# Altium schematic sheet P06 Power3.SchDoc
size 420 x 297 mm
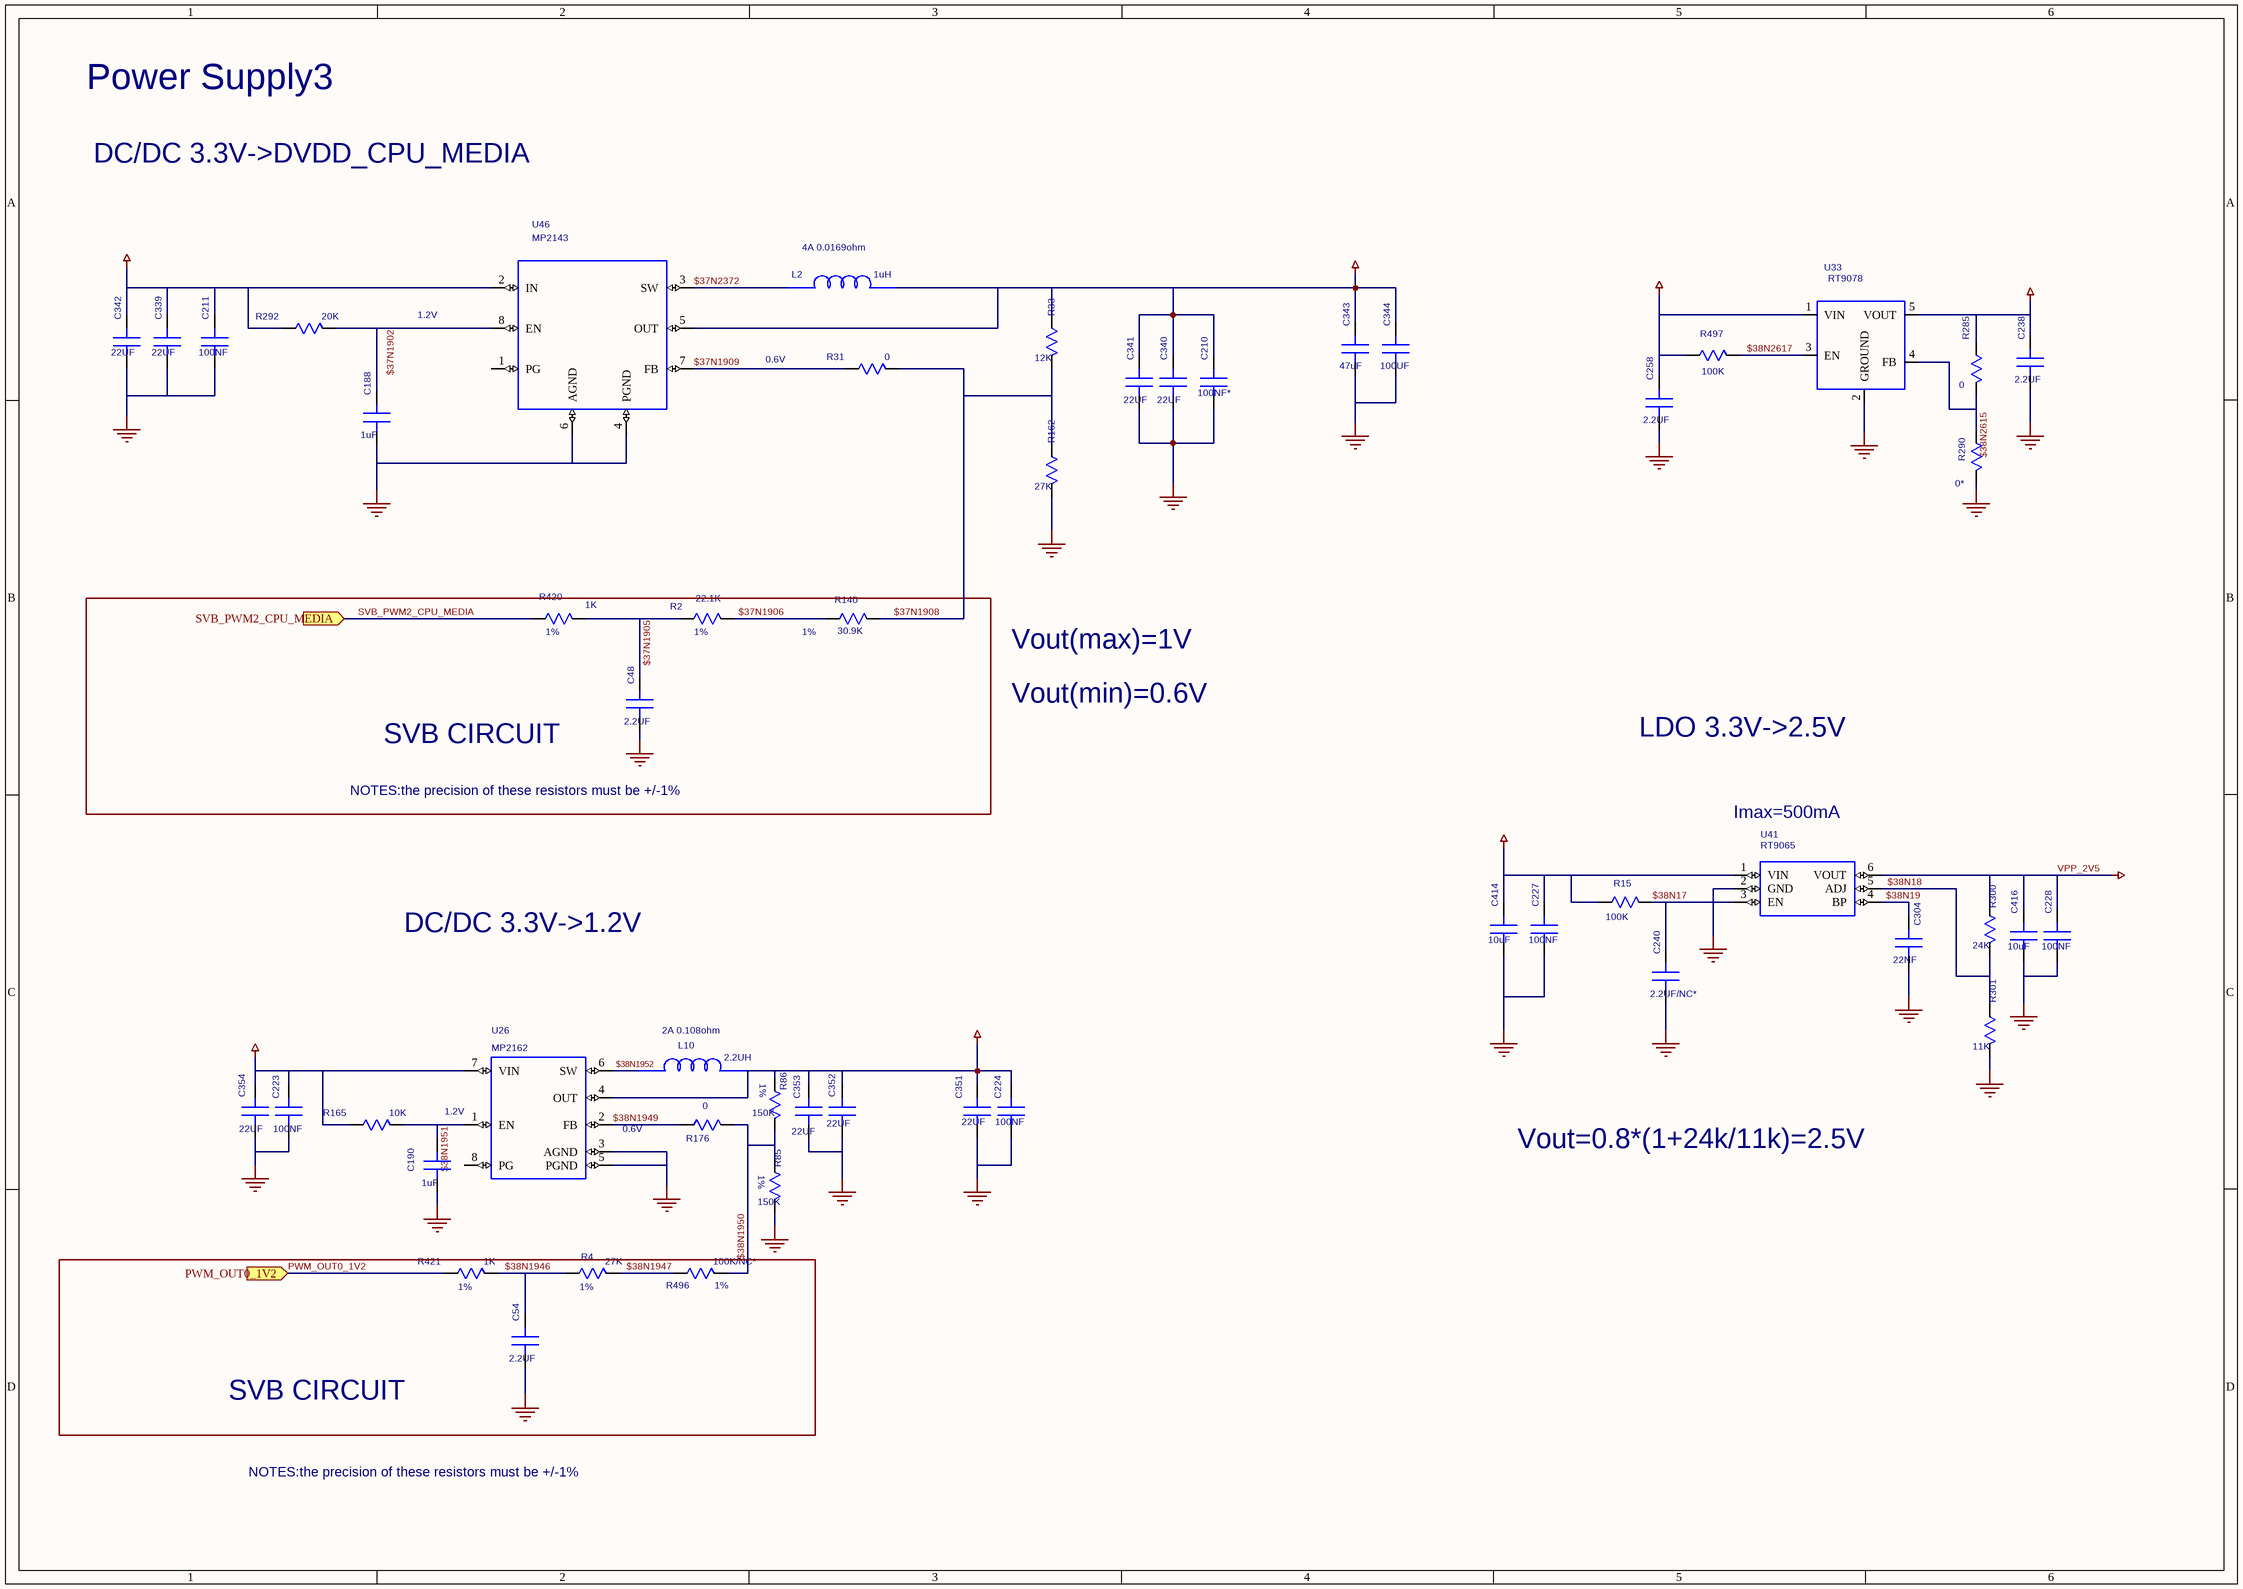
[diagram p0: P06 Power3.SchDoc]

## Parts
C48  2.2UF  [HSC0402]
C54  2.2UF  [HSC0402]
C188  1uF  [SC0402]
C190  1uF  [SC0402]
C210  100NF*  [SC0402]
C211  100NF  [SC0402]
C223  100NF  [SC0402]
C224  100NF  [SC0402]
C227  100NF  [SC0402]
C228  100NF  [SC0402]
C238  2.2UF  [SC0603]
C240  2.2UF/NC*  [SC0603]
C258  2.2UF  [SC0603]
C304  22NF  [SC0402]
C339  22UF  [SC1206]
C340  22UF  [SC1206]
C341  22UF  [SC1206]
C342  22UF  [SC1206]
C343  47uF  [SC1206]
C344  100UF  [SAC6666]
C351  22UF  [SC1206]
C352  22UF  [SC1206]
C353  22UF  [SC1206]
C354  22UF  [SC1206]
C414  10uF  [SC0603]
C416  10uF  [SC0603]
L2  1uH  [SPL0404B]
L10  2.2UH  [HSL1008]
R2  22.1K  [SR0603]
R4  27K  [SR0603]
R15  100K  [SR0402]
R31  0  [SR0402]
R33  12K  [SR0603]
R85  150K  [SR0603]
R86  150K  [SR0603]
R140  30.9K  [SR0603]
R162  27K  [SR0603]
R165  10K  [SR0402]
R176  0  [SR0402]
R285  0  [SR0402]
R290  0*  [SR0402]
R292  20K  [SR0402]
R300  24K  [SR0402]
R301  11K  [SR0402]
R420  1K  [SR0402]
R421  1K  [SR0402]
R496  100K/NC*  [SR0402]
R497  100K  [SR0402]
U26  MP2162  [MLF8M-050-0202L]
U33  RT9078  [SOT23-5-STB]
U41  RT9065  [SOT23-6B]
U46  MP2143  [TSOT23-8]

## Blocks framed on the sheet
SVB CIRCUIT: C48 R2 R140 R420
SVB CIRCUIT: C54 R4 R421 R496

## Ports
PWM_OUT0_1V2, SVB_PWM2_CPU_MEDIA

## Nets
0V8_LDO: C238.1(A) R285.1(A) U33.5(VOUT)
1V2: C224.1(A) C351.1(A) C352.1(A) C353.1(A) L10.2(B) R86.1(A) U26.4(OUT)
1V8: C258.1(A) R497.1(A) U33.1(VIN)
3V3: C211.1(A) C223.1(A) C227.1(A) C339.1(A) C342.1(A) C354.1(A) C414.1(A) R15.1(A) R165.1(A) R292.1(A) U26.7(VIN) U41.1(VIN) U46.2(IN)
DVDD_CPU_MEDIA: C210.1(A) C340.1(A) C341.1(A) C343.1(A) C344.1(A) L2.2(B) R33.1(A) U46.5(OUT)
GND: C48.2(B) C54.2(B) C188.2(B) C190.2(B) C210.2(B) C211.2(B) C223.2(B) C224.2(B) C227.2(B) C228.2(B) C238.2(B) C240.2(B) C258.2(B) C304.2(B) C339.2(B) C340.2(B) C341.2(B) C342.2(B) C343.2(B) C344.2(B) C351.2(B) C352.2(B) C353.2(B) C354.2(B) C414.2(B) C416.2(B) R85.2(B) R162.2(B) R290.2(B) R301.2(B) U26.3(AGND) U26.5(PGND) U33.2(GROUND) U41.2(GND) U46.4(PGND) U46.6(AGND)
VPP_2V5: C228.1(A) C416.1(A) R300.1(A) U41.6(VOUT)
$37N1902: C188.1(A) R292.2(B) U46.8(EN)
$37N1905: C48.1(A) R2.1(A) R420.2(B)
$37N1906: R2.2(B) R140.1(A)
$37N1908: R31.2(B) R33.2(B) R140.2(B) R162.1(A)
$37N1909: R31.1(A) U46.7(FB)
$37N2372: L2.1(A) U46.3(SW)
$38N17: C240.1(A) R15.2(B) U41.3(EN)
$38N18: R300.2(B) R301.1(A) U41.5(ADJ)
$38N19: C304.1(A) U41.4(BP)
$38N1946: C54.1(A) R4.1(A) R421.2(B)
$38N1947: R4.2(B) R496.1(A)
$38N1949: R176.1(A) U26.2(FB)
$38N1950: R85.1(A) R86.2(B) R176.2(B) R496.2(B)
$38N1951: C190.1(A) R165.2(B) U26.1(EN)
$38N1952: L10.1(A) U26.6(SW)
$38N2615: R285.2(B) R290.1(A) U33.4(FB)
$38N2617: R497.2(B) U33.3(EN)
PWM_OUT0_1V2: R421.1(A) ; port PWM_OUT0_1V2
SVB_PWM2_CPU_MEDIA: R420.1(A) ; port SVB_PWM2_CPU_MEDIA

Not connected (* = marked no-connect by the designer): U26 8(PG); U46 1(PG)

## Notes on the sheet
- Power Supply3
- DC/DC 3.3V->DVDD_CPU_MEDIA
- (near L2) 4A 0.0169ohm
- 1.2V
- 0.6V
- (near R420) 1%
- (near R2) 1%
- (near R140) 1%
- Vout(max)=1V
- Vout(min)=0.6V
- NOTES:the precision of these resistors must be +/-1%
- LDO 3.3V->2.5V
- (near U41) Imax=500mA
- DC/DC 3.3V->1.2V
- (near L10) 2A 0.108ohm
- 1%
- (near R85) 1%
- Vout=0.8*(1+24k/11k)=2.5V
- (near R421) 1%
- (near R4) 1%
- (near R496) 1%

## Library data of the parts
C48 = C: PARTS: 1; OriginalSymbolOrigin: (0,0); DEVICE: GRM155C70J225KE11D; LEVEL: STD; PINSWAP: (A,B); CODE: 8071990; %195%%232%%202%%246%: SMD陶瓷电容-6.3V-2200nF-+/-10%-X7S-0402; %182%%238%%182%%168%%185%%164%%215%%247%%181%%231%%209%%185%(V): 6.3; COMPONENT_HIGH_MAX: 0.7mm; %208%%161%%192%%224%%195%%251%%179%%198%: SMD陶瓷电容; PKG_TYPE: HSC0402
C54 = C: PARTS: 1; OriginalSymbolOrigin: (0,0); DEVICE: GRM155C70J225KE11D; LEVEL: STD; PINSWAP: (A,B); %208%%161%%192%%224%%195%%251%%179%%198%: SMD陶瓷电容; %195%%232%%202%%246%: SMD陶瓷电容-6.3V-2200nF-+/-10%-X7S-0402; CODE: 8071990; COMPONENT_HIGH_MAX: 0.7mm; %182%%238%%182%%168%%185%%164%%215%%247%%181%%231%%209%%185%(V): 6.3; PKG_TYPE: HSC0402
C188 = C: PARTS: 1; OriginalSymbolOrigin: (0,0); DEVICE: C1005X6S1A105KT000F; LEVEL: STD; PINSWAP: (A,B); CODE: 8071747; %195%%232%%202%%246%: SMD陶瓷电容-10V-1000nF-+/-10%-X6S-0402; %182%%238%%182%%168%%185%%164%%215%%247%%181%%231%%209%%185%(V): 10; COMPONENT_HIGH_MAX: 0.6mm; %208%%161%%192%%224%%195%%251%%179%%198%: SMD陶瓷电容; PKG_TYPE: SC0402
C190 = C: PARTS: 1; OriginalSymbolOrigin: (0,0); DEVICE: C1005X6S1A105KT000F; LEVEL: STD; PINSWAP: (A,B); %208%%161%%192%%224%%195%%251%%179%%198%: SMD陶瓷电容; COMPONENT_HIGH_MAX: 0.6mm; %182%%238%%182%%168%%185%%164%%215%%247%%181%%231%%209%%185%(V): 10; %195%%232%%202%%246%: SMD陶瓷电容-10V-1000nF-+/-10%-X6S-0402; CODE: 8071747; PKG_TYPE: SC0402
C210 = C: PARTS: 1; OriginalSymbolOrigin: (0,0); DEVICE: RMEMK105BJ104KV_FR; LEVEL: STD; PINSWAP: (A,B); %208%%161%%192%%224%%195%%251%%179%%198%: SMD陶瓷电容; COMPONENT_HIGH_MAX: 0.55MM; %182%%238%%182%%168%%185%%164%%215%%247%%181%%231%%209%%185%(V): 16; %195%%232%%202%%246%: SMD陶瓷电容-16V-100NF-+/-10%-X7R-0402-BT; CODE: 8070614; VARIANT_ID: $37I1928; PKG_TYPE: SC0402
C211 C224 = C: PARTS: 1; OriginalSymbolOrigin: (0,0); DEVICE: RMEMK105BJ104KV_FR; LEVEL: STD; PINSWAP: (A,B); %208%%161%%192%%224%%195%%251%%179%%198%: SMD陶瓷电容; COMPONENT_HIGH_MAX: 0.55MM; %182%%238%%182%%168%%185%%164%%215%%247%%181%%231%%209%%185%(V): 16; %195%%232%%202%%246%: SMD陶瓷电容-16V-100NF-+/-10%-X7R-0402-BT; CODE: 8070614; PKG_TYPE: SC0402
C223 = C: PARTS: 1; OriginalSymbolOrigin: (0,0); DEVICE: RMEMK105BJ104KV_FR; LEVEL: STD; PINSWAP: (A,B); %182%%238%%182%%168%%185%%164%%215%%247%%181%%231%%209%%185%(V): 16; COMPONENT_HIGH_MAX: 0.55MM; CODE: 8070614; %195%%232%%202%%246%: SMD陶瓷电容-16V-100nF-+/-10%-X7R-0402-BT; %208%%161%%192%%224%%195%%251%%179%%198%: SMD陶瓷电容; PKG_TYPE: SC0402
C227 C228 = C: PARTS: 1; OriginalSymbolOrigin: (0,0); DEVICE: RMEMK105BJ104KV_FR; LEVEL: STD; PINSWAP: (A,B); %182%%238%%182%%168%%185%%164%%215%%247%%181%%231%%209%%185%(V): 16; COMPONENT_HIGH_MAX: 0.55MM; CODE: 8070614; %195%%232%%202%%246%: SMD陶瓷电容-16V-100NF-+/-10%-X7R-0402-BT; %208%%161%%192%%224%%195%%251%%179%%198%: SMD陶瓷电容; PKG_TYPE: SC0402
C238 = C: PARTS: 1; OriginalSymbolOrigin: (0,0); DEVICE: GRM188R61A225KE34D; LEVEL: STD; PINSWAP: (A,B); VARIANT_ID: $38I2574; %208%%161%%192%%224%%195%%251%%179%%198%: SMD陶瓷电容; %195%%232%%202%%246%: SMD陶瓷电容-10V-2200NF-+/-10%-X5R-0603; CODE: 8070573; %182%%238%%182%%168%%185%%164%%215%%247%%181%%231%%209%%185%(V): 10; COMPONENT_HIGH_MAX: 0.9MM; PKG_TYPE: SC0603
C240 = C: PARTS: 1; OriginalSymbolOrigin: (0,0); DEVICE: GRM188R61A225KE34D; LEVEL: STD; PINSWAP: (A,B); COMPONENT_HIGH_MAX: 0.9MM; %182%%238%%182%%168%%185%%164%%215%%247%%181%%231%%209%%185%(V): 10; CODE: 8070573; %195%%232%%202%%246%: SMD陶瓷电容-10V-2200NF-+/-10%-X5R-0603; %208%%161%%192%%224%%195%%251%%179%%198%: SMD陶瓷电容; VARIANT_ID: $38I60; PKG_TYPE: SC0603
C258 = C: PARTS: 1; OriginalSymbolOrigin: (0,0); DEVICE: GRM188R61A225KE34D; LEVEL: STD; PINSWAP: (A,B); %195%%232%%202%%246%: SMD陶瓷电容-10V-2200NF-+/-10%-X5R-0603; %208%%161%%192%%224%%195%%251%%179%%198%: SMD陶瓷电容; VARIANT_ID: $38I2574; COMPONENT_HIGH_MAX: 0.9MM; %182%%238%%182%%168%%185%%164%%215%%247%%181%%231%%209%%185%(V): 10; CODE: 8070573; PKG_TYPE: SC0603
C304 = C: PARTS: 1; OriginalSymbolOrigin: (0,0); DEVICE: 0402YC223KAT2A; LEVEL: STD; PINSWAP: (A,B); %208%%161%%192%%224%%195%%251%%179%%198%: SMD陶瓷电容; %195%%232%%202%%246%: SMD陶瓷电容-16V-22NF-+/-10%-X7R-0402; CODE: 8070451; %182%%238%%182%%168%%185%%164%%215%%247%%181%%231%%209%%185%(V): 16; COMPONENT_HIGH_MAX: 0.56MM; PKG_TYPE: SC0402
C339 C342 = C: PARTS: 1; OriginalSymbolOrigin: (0,0); DEVICE: CEJMK316B7226ML_T; LEVEL: STD; PINSWAP: (A,B); %208%%161%%192%%224%%195%%251%%179%%198%: SMD陶瓷电容; COMPONENT_HIGH_MAX: 1.8mm; %182%%238%%182%%168%%185%%164%%215%%247%%181%%231%%209%%185%(V): 6.3; %195%%232%%202%%246%: SMD陶瓷电容-6.3V-22000nF-+/-20%-X7R-1206-所有; CODE: 8070862; PKG_TYPE: SC1206
C340 C341 = C: PARTS: 1; OriginalSymbolOrigin: (0,0); DEVICE: CEJMK316B7226ML_T; LEVEL: STD; PINSWAP: (A,B); CODE: 8070862; %195%%232%%202%%246%: SMD陶瓷电容-6.3V-22000nF-+/-20%-X7R-1206-所有; %182%%238%%182%%168%%185%%164%%215%%247%%181%%231%%209%%185%(V): 6.3; COMPONENT_HIGH_MAX: 1.8mm; %208%%161%%192%%224%%195%%251%%179%%198%: SMD陶瓷电容; PKG_TYPE: SC1206
C343 = C: PARTS: 1; OriginalSymbolOrigin: (0,0); DEVICE: C3216X7S0J476MT000E; LEVEL: STD; PINSWAP: (A,B); %208%%161%%192%%224%%195%%251%%179%%198%: SMD陶瓷电容; COMPONENT_HIGH_MAX: 1.8mm; %182%%238%%182%%168%%185%%164%%215%%247%%181%%231%%209%%185%(V): 4; %195%%232%%202%%246%: SMD陶瓷电容-4V-47000nF-+/-20%-X7S-1206; CODE: 8071432; VARIANT_ID: $37I2387; PKG_TYPE: SC1206
C344 = C: PARTS: 1; OriginalSymbolOrigin: (0,0); DEVICE: CEJMK316B7226ML_T; LEVEL: STD; PINSWAP: (A,B); %208%%161%%192%%224%%195%%251%%179%%198%: 非固体SMD铝电容; COMPONENT_HIGH_MAX: 6.1mm; %182%%238%%182%%168%%185%%164%%215%%247%%181%%231%%209%%185%(V): 16; %195%%232%%202%%246%: 非固体SMD铝电容-16V-100uF-+/-20%-6.3*5.8mm-极性-105degC-2000h-SMD; CODE: 8120045; VARIANT_ID: $37I2400; PKG_TYPE: SAC6666
C351 C353 = C: PARTS: 1; OriginalSymbolOrigin: (0,0); DEVICE: CEJMK316B7226ML_T; LEVEL: STD; PINSWAP: (A,B); %208%%161%%192%%224%%195%%251%%179%%198%: SMD陶瓷电容; %195%%232%%202%%246%: SMD陶瓷电容-6.3V-22000nF-+/-20%-X7R-1206-所有; CODE: 8070862; COMPONENT_HIGH_MAX: 1.8mm; %182%%238%%182%%168%%185%%164%%215%%247%%181%%231%%209%%185%(V): 6.3; PKG_TYPE: SC1206
C352 C354 = C: PARTS: 1; OriginalSymbolOrigin: (0,0); DEVICE: CEJMK316B7226ML_T; LEVEL: STD; PINSWAP: (A,B); %182%%238%%182%%168%%185%%164%%215%%247%%181%%231%%209%%185%(V): 6.3; COMPONENT_HIGH_MAX: 1.8mm; CODE: 8070862; %195%%232%%202%%246%: SMD陶瓷电容-6.3V-22000nF-+/-20%-X7R-1206-所有; %208%%161%%192%%224%%195%%251%%179%%198%: SMD陶瓷电容; PKG_TYPE: SC1206
C414 C416 = C: PARTS: 1; OriginalSymbolOrigin: (0,0); DEVICE: C1608X7S0J106MT000E; LEVEL: STD; PINSWAP: (A,B); %182%%238%%182%%168%%185%%164%%215%%247%%181%%231%%209%%185%(V): 6.3; COMPONENT_HIGH_MAX: 1mm; CODE: 8071624; %195%%232%%202%%246%: SMD陶瓷电容-6.3V-10000nF-+/-20%-X7T-0603; %208%%161%%192%%224%%195%%251%%179%%198%: SMD陶瓷电容; PKG_TYPE: SC0603
L2 = L: PARTS: 1; DEVICE: XAL4020_102MED; LEVEL: STD; OriginalSymbolOrigin: (-20,0); %208%%161%%192%%224%%195%%251%%179%%198%: 贴片电感器; COMPONENT_HIGH_MAX: 2.1MM; %195%%232%%202%%246%: 贴片电感器-1uH-+/-20%-0.014ohm-8.7A-40degC-4*4*2mm; CODE: 10031479; PKG_TYPE: SPL0404B
L10 = L: PARTS: 1; DEVICE: 1239AS_H_2R2N_P2; LEVEL: STD; OriginalSymbolOrigin: (-20,0); COMPONENT_HIGH_MAX: 1.2MM; CODE: 10100175; %195%%232%%202%%246%: 终端功率电感-2.2uH-+/-30%-2A-0.108ohm-2.5*2.0*1.2mm-1008-2.2A; %208%%161%%192%%224%%195%%251%%179%%198%: 终端功率电感; PKG_TYPE: HSL1008
R2 = R_Dup1: PARTS: 1; OriginalSymbolOrigin: (0,0); PINSWAP: (A,B); DEVICE: RK73H1JTTD2212F; LEVEL: STD; %208%%161%%192%%224%%195%%251%%179%%198%: 片式厚膜电阻器; COMPONENT_HIGH_MAX: 0.55mm; %215%%232%%214%%181%%212%%202%%208%%237%%198%%171%%178%%238%: +/-1%; %182%%238%%182%%168%%185%%166%%194%%202%(W): 0.1; %195%%232%%202%%246%: 片式厚膜电阻器-0.1W-22100ohm-+/-1%-0603; CODE: 7091267; PKG_TYPE: SR0603
R4 = R_Dup1: PARTS: 1; OriginalSymbolOrigin: (0,0); PINSWAP: (A,B); DEVICE: RC0603FR_0727KL; LEVEL: STD; COMPONENT_HIGH_MAX: 0.55MM; CODE: 7091669; %195%%232%%202%%246%: 片式厚膜电阻器-0.1W-27000ohm-+/-1%-0603--供电专用 07090937-供电专用; %208%%161%%192%%224%%195%%251%%179%%198%: 片式厚膜电阻器; PKG_TYPE: SR0603
R15 R497 = R_Dup1: PARTS: 1; OriginalSymbolOrigin: (0,0); PINSWAP: (A,B); DEVICE: RK73H1ETTP1003F; LEVEL: STD; COMPONENT_HIGH_MAX: 0.4mm; CODE: 7090875; %195%%232%%202%%246%: 片式厚膜电阻器-0.0625W-100000ohm-+/-1%-0402; %208%%161%%192%%224%%195%%251%%179%%198%: 片式厚膜电阻器; PKG_TYPE: SR0402
R31 = R_Dup1: PARTS: 1; OriginalSymbolOrigin: (0,0); PINSWAP: (A,B); DEVICE: RC0402JR_070R; LEVEL: STD; %215%%232%%214%%181%%212%%202%%208%%237%%198%%171%%178%%238%: < 50mohm; %182%%238%%182%%168%%185%%166%%194%%202%(W): 0.06; CODE: 7090800; %195%%232%%202%%246%: 片式厚膜电阻器-0.0625W-0ohm-< 50mohm-0402-1A-BT; COMPONENT_HIGH_MAX: 0.4mm; %208%%161%%192%%224%%195%%251%%179%%198%: 片式厚膜电阻器; PKG_TYPE: SR0402
R33 = R_Dup1: PARTS: 1; OriginalSymbolOrigin: (0,0); PINSWAP: (A,B); DEVICE: RHS_03K123FT; LEVEL: STD; CODE: 7091203; %195%%232%%202%%246%: 片式厚膜电阻器-0.1W-12000ohm-+/-1%-0603; %182%%238%%182%%168%%185%%166%%194%%202%(W): 0.1; %215%%232%%214%%181%%212%%202%%208%%237%%198%%171%%178%%238%: +/-1%; COMPONENT_HIGH_MAX: 0.55mm; %208%%161%%192%%224%%195%%251%%179%%198%: 片式厚膜电阻器; PKG_TYPE: SR0603
R85 R86 = R_Dup1: PARTS: 1; OriginalSymbolOrigin: (0,0); PINSWAP: (A,B); DEVICE: RK73H1JTTD1503F; LEVEL: STD; %208%%161%%192%%224%%195%%251%%179%%198%: 片式厚膜电阻器; %195%%232%%202%%246%: 片式厚膜电阻器-0.1W-150000ohm-+/-1%-0603; CODE: 7091239; COMPONENT_HIGH_MAX: 0.55MM; PKG_TYPE: SR0603
R140 = R_Dup1: PARTS: 1; OriginalSymbolOrigin: (0,0); PINSWAP: (A,B); DEVICE: RC_03K3092FT; LEVEL: STD; %215%%232%%214%%181%%212%%202%%208%%237%%198%%171%%178%%238%: +/-1%; %182%%238%%182%%168%%185%%166%%194%%202%(W): 0.1; %208%%161%%192%%224%%195%%251%%179%%198%: 片式厚膜电阻器; COMPONENT_HIGH_MAX: 0.55mm; %195%%232%%202%%246%: 片式厚膜电阻器-0.1W-30900ohm-+/-1%-0603; CODE: 7090665; PKG_TYPE: SR0603
R162 = R_Dup1: PARTS: 1; OriginalSymbolOrigin: (0,0); PINSWAP: (A,B); DEVICE: RK73H1JTTD2702F; LEVEL: STD; %208%%161%%192%%224%%195%%251%%179%%198%: 片式厚膜电阻器; COMPONENT_HIGH_MAX: 0.55mm; %195%%232%%202%%246%: 片式厚膜电阻器-0.1W-27000ohm-+/-1%-0603; CODE: 7090937; %182%%238%%182%%168%%185%%166%%194%%202%(W): 0.1; %215%%232%%214%%181%%212%%202%%208%%237%%198%%171%%178%%238%: +/-1%; PKG_TYPE: SR0603
R165 = R_Dup1: PARTS: 1; OriginalSymbolOrigin: (0,0); PINSWAP: (A,B); DEVICE: RC_02W103JT; LEVEL: STD; CODE: 7090815; %195%%232%%202%%246%: 片式厚膜电阻器-0.0625W-10000ohm-+/-5%-0402-BT; %182%%238%%182%%168%%185%%166%%194%%202%(W): 0.06; %215%%232%%214%%181%%212%%202%%208%%237%%198%%171%%178%%238%: +/-5%; COMPONENT_HIGH_MAX: 0.4mm; %208%%161%%192%%224%%195%%251%%179%%198%: 片式厚膜电阻器; PKG_TYPE: SR0402
R176 = R_Dup1: PARTS: 1; OriginalSymbolOrigin: (0,0); PINSWAP: (A,B); DEVICE: RC0402JR_070R; LEVEL: STD; %208%%161%%192%%224%%195%%251%%179%%198%: 片式厚膜电阻器; %195%%232%%202%%246%: 片式厚膜电阻器-0.0625W-0ohm-< 50mohm-0402-1A-BT; CODE: 7090800; COMPONENT_HIGH_MAX: 0.4MM; PKG_TYPE: SR0402
R285 = R_Dup1: PARTS: 1; OriginalSymbolOrigin: (0,0); PINSWAP: (A,B); DEVICE: RC0402JR_070R; LEVEL: STD; CODE: 7090800; %195%%232%%202%%246%: 片式厚膜电阻器-0.0625W-0ohm-< 50mohm-0402-1A-BT; %182%%238%%182%%168%%185%%166%%194%%202%(W): 0.06; %215%%232%%214%%181%%212%%202%%208%%237%%198%%171%%178%%238%: < 50mohm; COMPONENT_HIGH_MAX: 0.4MM; %208%%161%%192%%224%%195%%251%%179%%198%: 片式厚膜电阻器; PKG_TYPE: SR0402
R290 = R_Dup1: PARTS: 1; OriginalSymbolOrigin: (0,0); PINSWAP: (A,B); DEVICE: RC0402JR_070R; LEVEL: STD; %195%%232%%202%%246%: 片式厚膜电阻器-0.0625W-0ohm-< 50mohm-0402-1A-BT; %182%%238%%182%%168%%185%%166%%194%%202%(W): 0.06; %215%%232%%214%%181%%212%%202%%208%%237%%198%%171%%178%%238%: < 50mohm; COMPONENT_HIGH_MAX: 0.4MM; %208%%161%%192%%224%%195%%251%%179%%198%: 片式厚膜电阻器; CODE: 7090800; PKG_TYPE: SR0402
R292 = R_Dup1: PARTS: 1; OriginalSymbolOrigin: (0,0); PINSWAP: (A,B); DEVICE: RC_02W2002FT; LEVEL: STD; CODE: 7091374; %195%%232%%202%%246%: 片式厚膜电阻器-0.0625W-20000ohm-+/-1%-0402-TS16949; %182%%238%%182%%168%%185%%166%%194%%202%(W): 0.06; %215%%232%%214%%181%%212%%202%%208%%237%%198%%171%%178%%238%: +/-1%; COMPONENT_HIGH_MAX: 99999999mm; %208%%161%%192%%224%%195%%251%%179%%198%: 片式厚膜电阻器; PKG_TYPE: SR0402
R300 = R_Dup1: PARTS: 1; OriginalSymbolOrigin: (0,0); PINSWAP: (A,B); DEVICE: RC_02W2402FT; LEVEL: STD; COMPONENT_HIGH_MAX: 0.4mm; CODE: 7091376; %195%%232%%202%%246%: 片式厚膜电阻器-0.0625W-24000ohm-+/-1%-0402; %208%%161%%192%%224%%195%%251%%179%%198%: 片式厚膜电阻器; PKG_TYPE: SR0402
R301 = R_Dup1: PARTS: 1; OriginalSymbolOrigin: (0,0); PINSWAP: (A,B); DEVICE: RK73H1ETTP1102F; LEVEL: STD; COMPONENT_HIGH_MAX: 0.4mm; CODE: 7091271; %195%%232%%202%%246%: 片式厚膜电阻器-0.0625W-11000ohm-+/-1%-0402-BT; %208%%161%%192%%224%%195%%251%%179%%198%: 片式厚膜电阻器; PKG_TYPE: SR0402
R420 = R_Dup1: PARTS: 1; OriginalSymbolOrigin: (0,0); PINSWAP: (A,B); DEVICE: RC0402FR_071KL; LEVEL: STD; CODE: 7091282; %195%%232%%202%%246%: 片式厚膜电阻器-0.0625W-1000OHM-+/-1%-0402-BT; %182%%238%%182%%168%%185%%166%%194%%202%(W): 0.06; COMPONENT_HIGH_MAX: 0.4MM; %208%%161%%192%%224%%195%%251%%179%%198%: 片式厚膜电阻器; %215%%232%%214%%181%%212%%202%%208%%237%%198%%171%%178%%238%: +/-1%; PKG_TYPE: SR0402
R421 = R_Dup1: PARTS: 1; OriginalSymbolOrigin: (0,0); PINSWAP: (A,B); DEVICE: RC0402FR_071KL; LEVEL: STD; %208%%161%%192%%224%%195%%251%%179%%198%: 片式厚膜电阻器; %195%%232%%202%%246%: 片式厚膜电阻器-0.0625W-1000ohm-+/-1%-0402-BT; CODE: 7091282; COMPONENT_HIGH_MAX: 0.4MM; PKG_TYPE: SR0402
R496 = R_Dup1: PARTS: 1; OriginalSymbolOrigin: (0,0); PINSWAP: (A,B); DEVICE: RK73H1ETTP1003F; LEVEL: STD; VARIANT_ID: $38I1968; %182%%238%%182%%168%%185%%166%%194%%202%(W): 0.06; %215%%232%%214%%181%%212%%202%%208%%237%%198%%171%%178%%238%: +/-1%; COMPONENT_HIGH_MAX: 0.4MM; CODE: 7090875; %195%%232%%202%%246%: 片式厚膜电阻器-0.0625W-100000OHM-+/-1%-0402; %208%%161%%192%%224%%195%%251%%179%%198%: 片式厚膜电阻器; PKG_TYPE: SR0402
U26 = MP2162: PARTS: 1; OriginalSymbolOrigin: (0,0); LEVEL: STD; DEVICE: MP2162GQH_Z; COMPONENT_HIGH_MAX: 1MM; CODE: 39110770; %195%%232%%202%%246%: SWITCHING REGULATORS-SYNC BUCK-SINGLE PHASE-2.5V-6V-0.6V-2A-1.5MHZ-QFN8-终端专用; %208%%161%%192%%224%%195%%251%%179%%198%: SWITCHING REGULATORS; PKG_TYPE: MLF8M-050-0202L
U33 = RT9078_0: PARTS: 1; OriginalSymbolOrigin: (0,0); LEVEL: STD; HETERO: RT9078; DEVICE: RT9078; PKG_TYPE: SOT23-5-STB
U41 = RT9065: PARTS: 1; OriginalSymbolOrigin: (0,0); LEVEL: STD; DEVICE: RT9065GE_A; %208%%161%%192%%224%%195%%251%%179%%198%: LDO; %195%%232%%202%%246%: LDO-可调型-2.2V-5.5V-5V-+/-2%-500mA-SOT23-5或SOT23-6-终端专用-00685057; CODE: 39110735; COMPONENT_HIGH_MAX: 1.3MM; PKG_TYPE: SOT23-6B
U46 = MP2143: PARTS: 1; OriginalSymbolOrigin: (0,0); LEVEL: STD; CODE: 99054LFT; DEVICE: MP2143; PKG_TYPE: TSOT23-8